# EAGLE design PCBSCH (EAGLE 7.6.0)
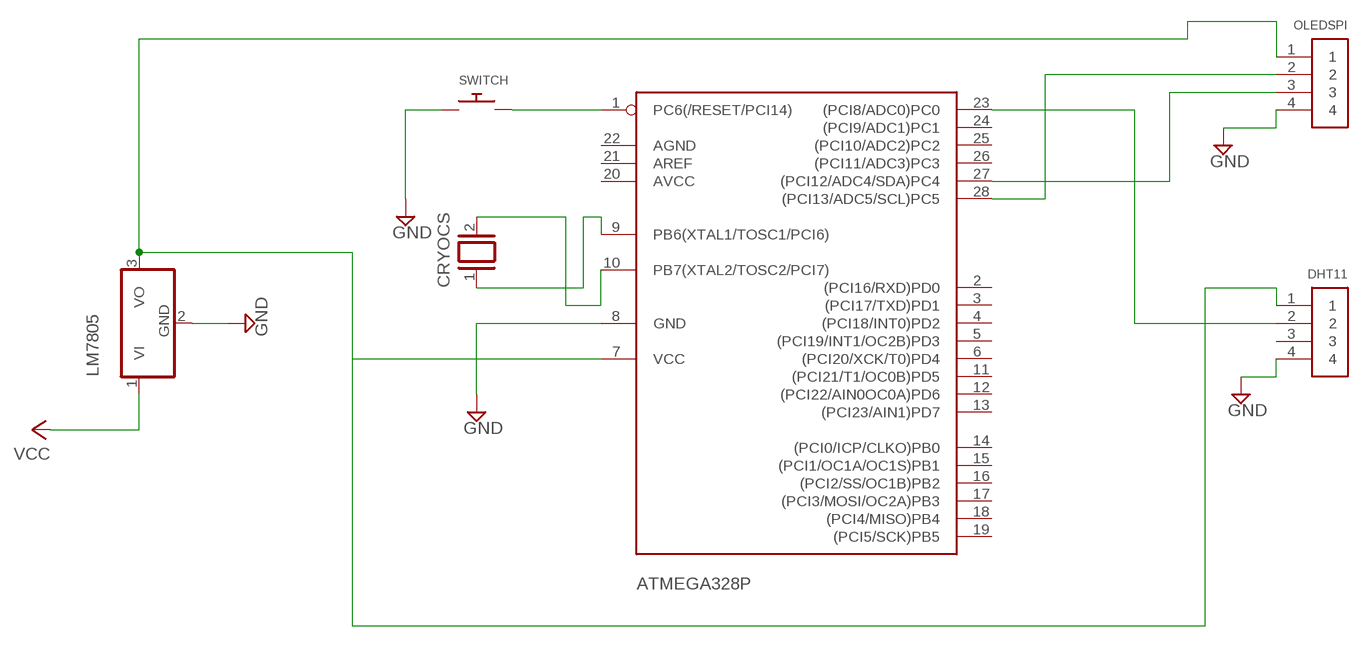
[diagram p0: schematic, sheet 1]

## Parts
ATMEGA328P  ATMEGA328PROUND  [DIL28-3-ROUND]
CRYOCS  XTAL/S  [QS]
DHT11  1X4-BIG  [1X04-BIG]
LM7805  7805TV  [TO220V]
OLEDSPI  1X4-BIG  [1X04-BIG]
SWITCH  SWITCH_PUSHBUTTONSOFTTOUCHSMD_SJ  [PUSHBUTTON_SMD_SJ]

## Nets
GND: ATMEGA328P.8(GND) DHT11.4 LM7805.2(GND) OLEDSPI.4 SWITCH.P$1
N$1: ATMEGA328P.7(VCC) DHT11.1 LM7805.3(VO) OLEDSPI.1
N$2: ATMEGA328P.1(PC6(/RESET/PCI14)) SWITCH.P$2
N$3: ATMEGA328P.27((PCI12/ADC4/SDA)PC4) OLEDSPI.3
N$4: ATMEGA328P.28((PCI13/ADC5/SCL)PC5) OLEDSPI.2
N$5: ATMEGA328P.23((PCI8/ADC0)PC0) DHT11.2
N$7: ATMEGA328P.9(PB6(XTAL1/TOSC1/PCI6)) CRYOCS.1
N$8: ATMEGA328P.10(PB7(XTAL2/TOSC2/PCI7)) CRYOCS.2
VCC: LM7805.1(VI)
Unconnected: ATMEGA328P.2((PCI16/RXD)PD0) ATMEGA328P.3((PCI17/TXD)PD1) ATMEGA328P.4((PCI18/INT0)PD2) ATMEGA328P.5((PCI19/INT1/OC2B)PD3) ATMEGA328P.6((PCI20/XCK/T0)PD4) ATMEGA328P.11((PCI21/T1/OC0B)PD5) ATMEGA328P.12((PCI22/AIN0OC0A)PD6) ATMEGA328P.13((PCI23/AIN1)PD7) ATMEGA328P.14((PCI0/ICP/CLKO)PB0) ATMEGA328P.15((PCI1/OC1A/OC1S)PB1) ATMEGA328P.16((PCI2/SS/OC1B)PB2) ATMEGA328P.17((PCI3/MOSI/OC2A)PB3) ATMEGA328P.18((PCI4/MISO)PB4) ATMEGA328P.19((PCI5/SCK)PB5) ATMEGA328P.20(AVCC) ATMEGA328P.21(AREF) ATMEGA328P.22(AGND) ATMEGA328P.24((PCI9/ADC1)PC1) ATMEGA328P.25((PCI10/ADC2)PC2) ATMEGA328P.26((PCI11/ADC3)PC3) DHT11.3

## Library data of the parts
ATMEGA328P = atmega328:ATMEGA328*P: MICROCONTROLLER 32 kBytes FLASH 2 kBytes SRAM 1 kBytes EEPROM USART 8-channel 10 bit ADC
CRYOCS = special:XTAL/S: CRYSTAL
DHT11 OLEDSPI = adafruit:1X4: 4-pin connector
LM7805 = linear:78*: Positive VOLTAGE REGULATOR Source: http://cache.national.com/ds/LM/LM78L05.pdf http://www.fairchildsemi.com/ds/LM/LM7805.pdf
SWITCH = adafruit:SWITCH_PUSHBUTTON: Buttons SOFTTOUCHSMD_SJ - Soft touch temporary push button (Super Junk Akihabara) Compatible with SKPMANE010 [Mouser: 688-SKPMAN] C&K_KSS = Digikey: KSS221GLFS

## Board
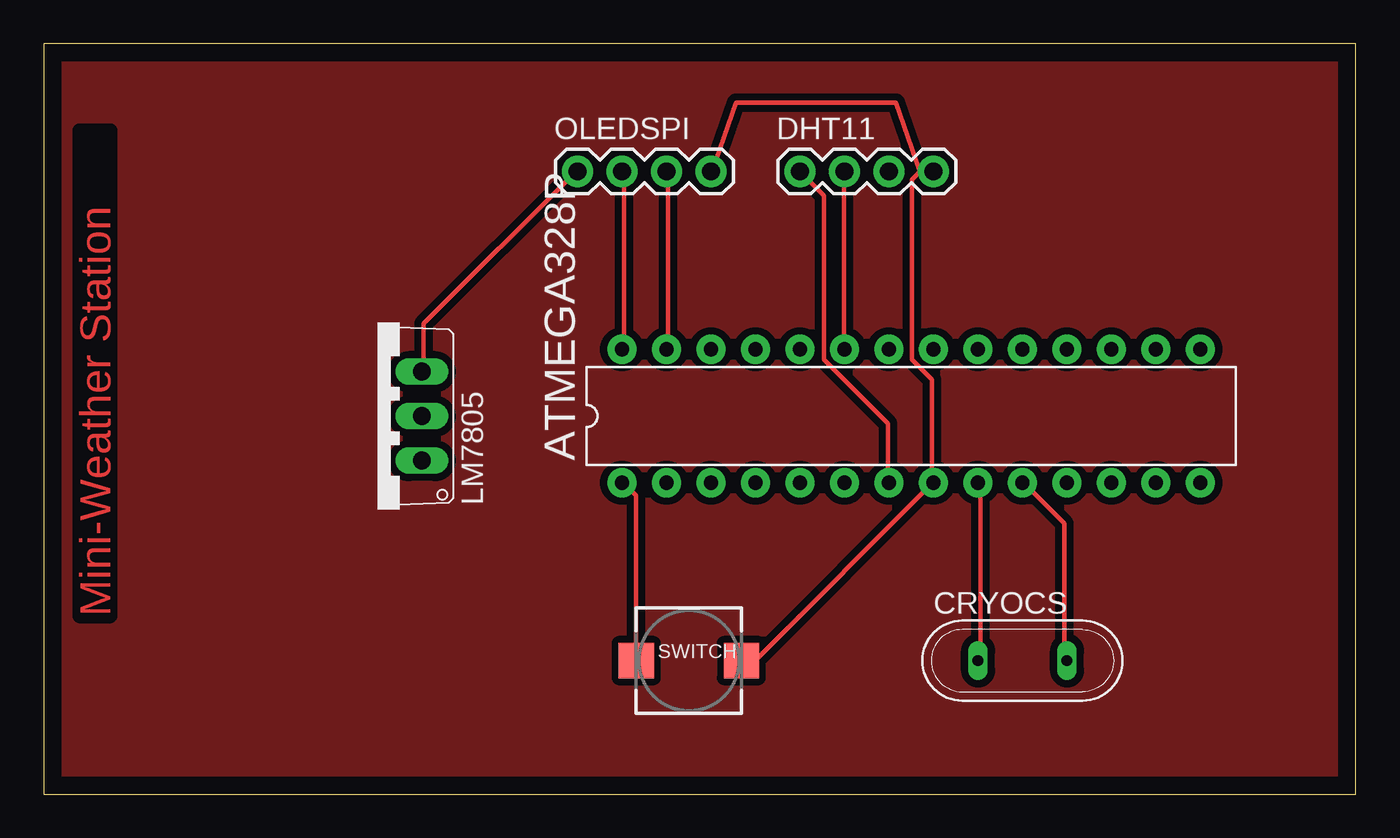
[diagram p1: board, top side]
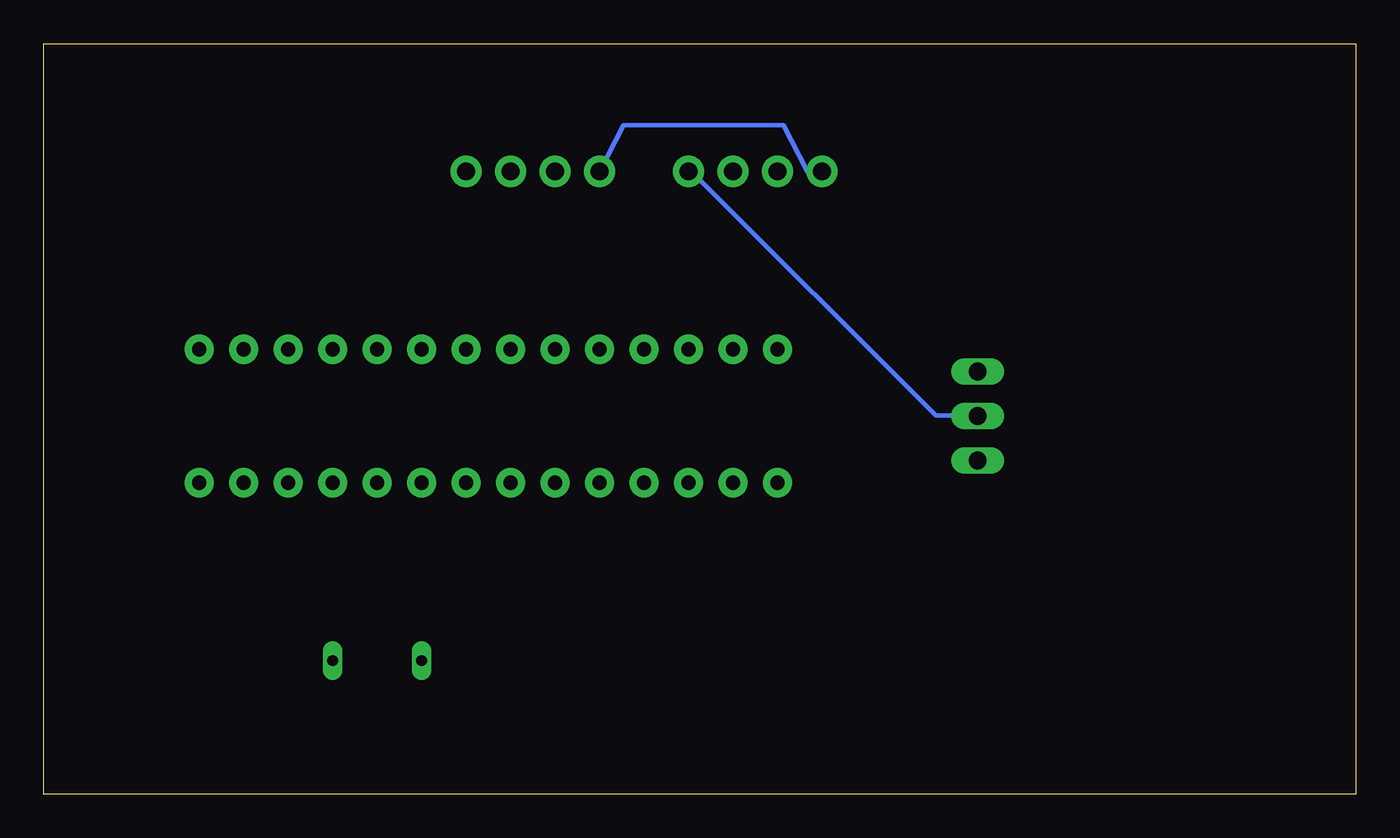
[diagram p2: board, bottom side, seen from below]

Size 74.91 x 42.85 mm. Coordinates in mm from the lower left corner, seen from the top.
Outline: 0,0 74.91,0 74.91,42.85 0,42.85 0,0
Copper layers (1*16): Top 0.035mm / dielectric 1.5mm / Bottom 0.035mm
Design rules "default *": minimum track width 10mil, minimum drill 24mil, track to track 8mil, track to pad 8mil, pad to pad 8mil, via to via 8mil, smd to smd 8mil, copper to edge 40mil, drill to drill 8mil, minimum pad ring 10mil, minimum via ring 8mil, stop-mask expansion 4mil, vias tented up to drill 0mil, thermal gap 10mil

### Footprints (pad centres in the part's own frame; a part is rotated, then mirrored left to right if it is on the bottom)
DIL28-3-ROUND = drill 0.813 pad 1.676: 1 -16.51,-3.81; 2 -13.97,-3.81; 3 -11.43,-3.81; 4 -8.89,-3.81; 5 -6.35,-3.81; 6 -3.81,-3.81; 7 -1.27,-3.81; 8 1.27,-3.81; 9 3.81,-3.81; 10 6.35,-3.81; 11 8.89,-3.81; 12 11.43,-3.81; 13 13.97,-3.81; 14 16.51,-3.81; 15 16.51,3.81; 16 13.97,3.81; 17 11.43,3.81; 18 8.89,3.81; 19 6.35,3.81; 20 3.81,3.81; 21 1.27,3.81; 22 -1.27,3.81; 23 -3.81,3.81; 24 -6.35,3.81; 25 -8.89,3.81; 26 -11.43,3.81; 27 -13.97,3.81; 28 -16.51,3.81
QS = drill 0.61 long: 1 -2.54,0; 2 2.54,0
1X04-BIG = drill 1.016 pad 1.778: 1 0,0; 2 2.54,0; 3 5.08,0; 4 7.62,0
TO220V = drill 1.016 long: 1 -2.54,-2.54; 2 0,-2.54; 3 2.54,-2.54
PUSHBUTTON_SMD_SJ = smd 2 x 2: P$1 3,0; P$2 -3,0

### Placement (x,y rotation side)
ATMEGA328P  49.53,21.59 0 top
CRYOCS  55.88,7.62 0 top
DHT11  43.18,35.56 0 top
LM7805  19.05,21.59 90 top
OLEDSPI  30.48,35.56 0 top
SWITCH  36.83,7.62 0 top

### Tracks (layer width: path | path; a pad name or v marks a point on that pad's centre or on a via)
GND
  Top 0.254: SWITCH.P$1 39.98,7.67 40.67,7.67 50.72,17.73 ATMEGA328P.8 50.72,17.96 50.72,23.67 49.58,24.82 49.58,35.1 50.04,35.56 | 50.04,35.56 DHT11.4 50.72,35.56 | 50.04,35.56 48.67,39.47 39.52,39.47 38.15,35.56 OLEDSPI.4
  Bottom 0.254: LM7805.2 21.69,21.61 23.98,21.61 37.92,35.56 OLEDSPI.4
N$1
  Top 0.254: LM7805.3 21.69,24.13 21.69,26.87 30.38,35.56 OLEDSPI.1 | DHT11.1 44.55,34.19 44.55,24.82 48.21,21.16 48.21,17.96 ATMEGA328P.7
  Bottom 0.254: OLEDSPI.1 31.29,35.56 32.66,38.2 41.81,38.2 DHT11.1
N$2
  Top 0.254: SWITCH.P$2 33.81,7.67 33.81,17.04 33.12,17.73 ATMEGA328P.1
N$3
  Top 0.254: ATMEGA328P.27 35.64,25.5 35.64,35.56 OLEDSPI.3
N$4
  Top 0.254: ATMEGA328P.28 33.12,25.5 33.12,35.56 OLEDSPI.2
N$5
  Top 0.254: ATMEGA328P.23 45.7,25.5 45.7,35.56 DHT11.2
N$6
  pour Top (isolate 0.406): 0,43.18 74.93,43.18 74.93,0 0,0
N$7
  Top 0.254: CRYOCS.1 53.47,7.67 53.47,17.73 ATMEGA328P.9
N$8
  Top 0.254: CRYOCS.2 58.27,7.67 58.27,15.44 55.98,17.73 ATMEGA328P.10

### Text on the board
Top: Mini-Weather Station